# Altium schematic sheet Senkron_buck.SchDoc (part 2 of 3)
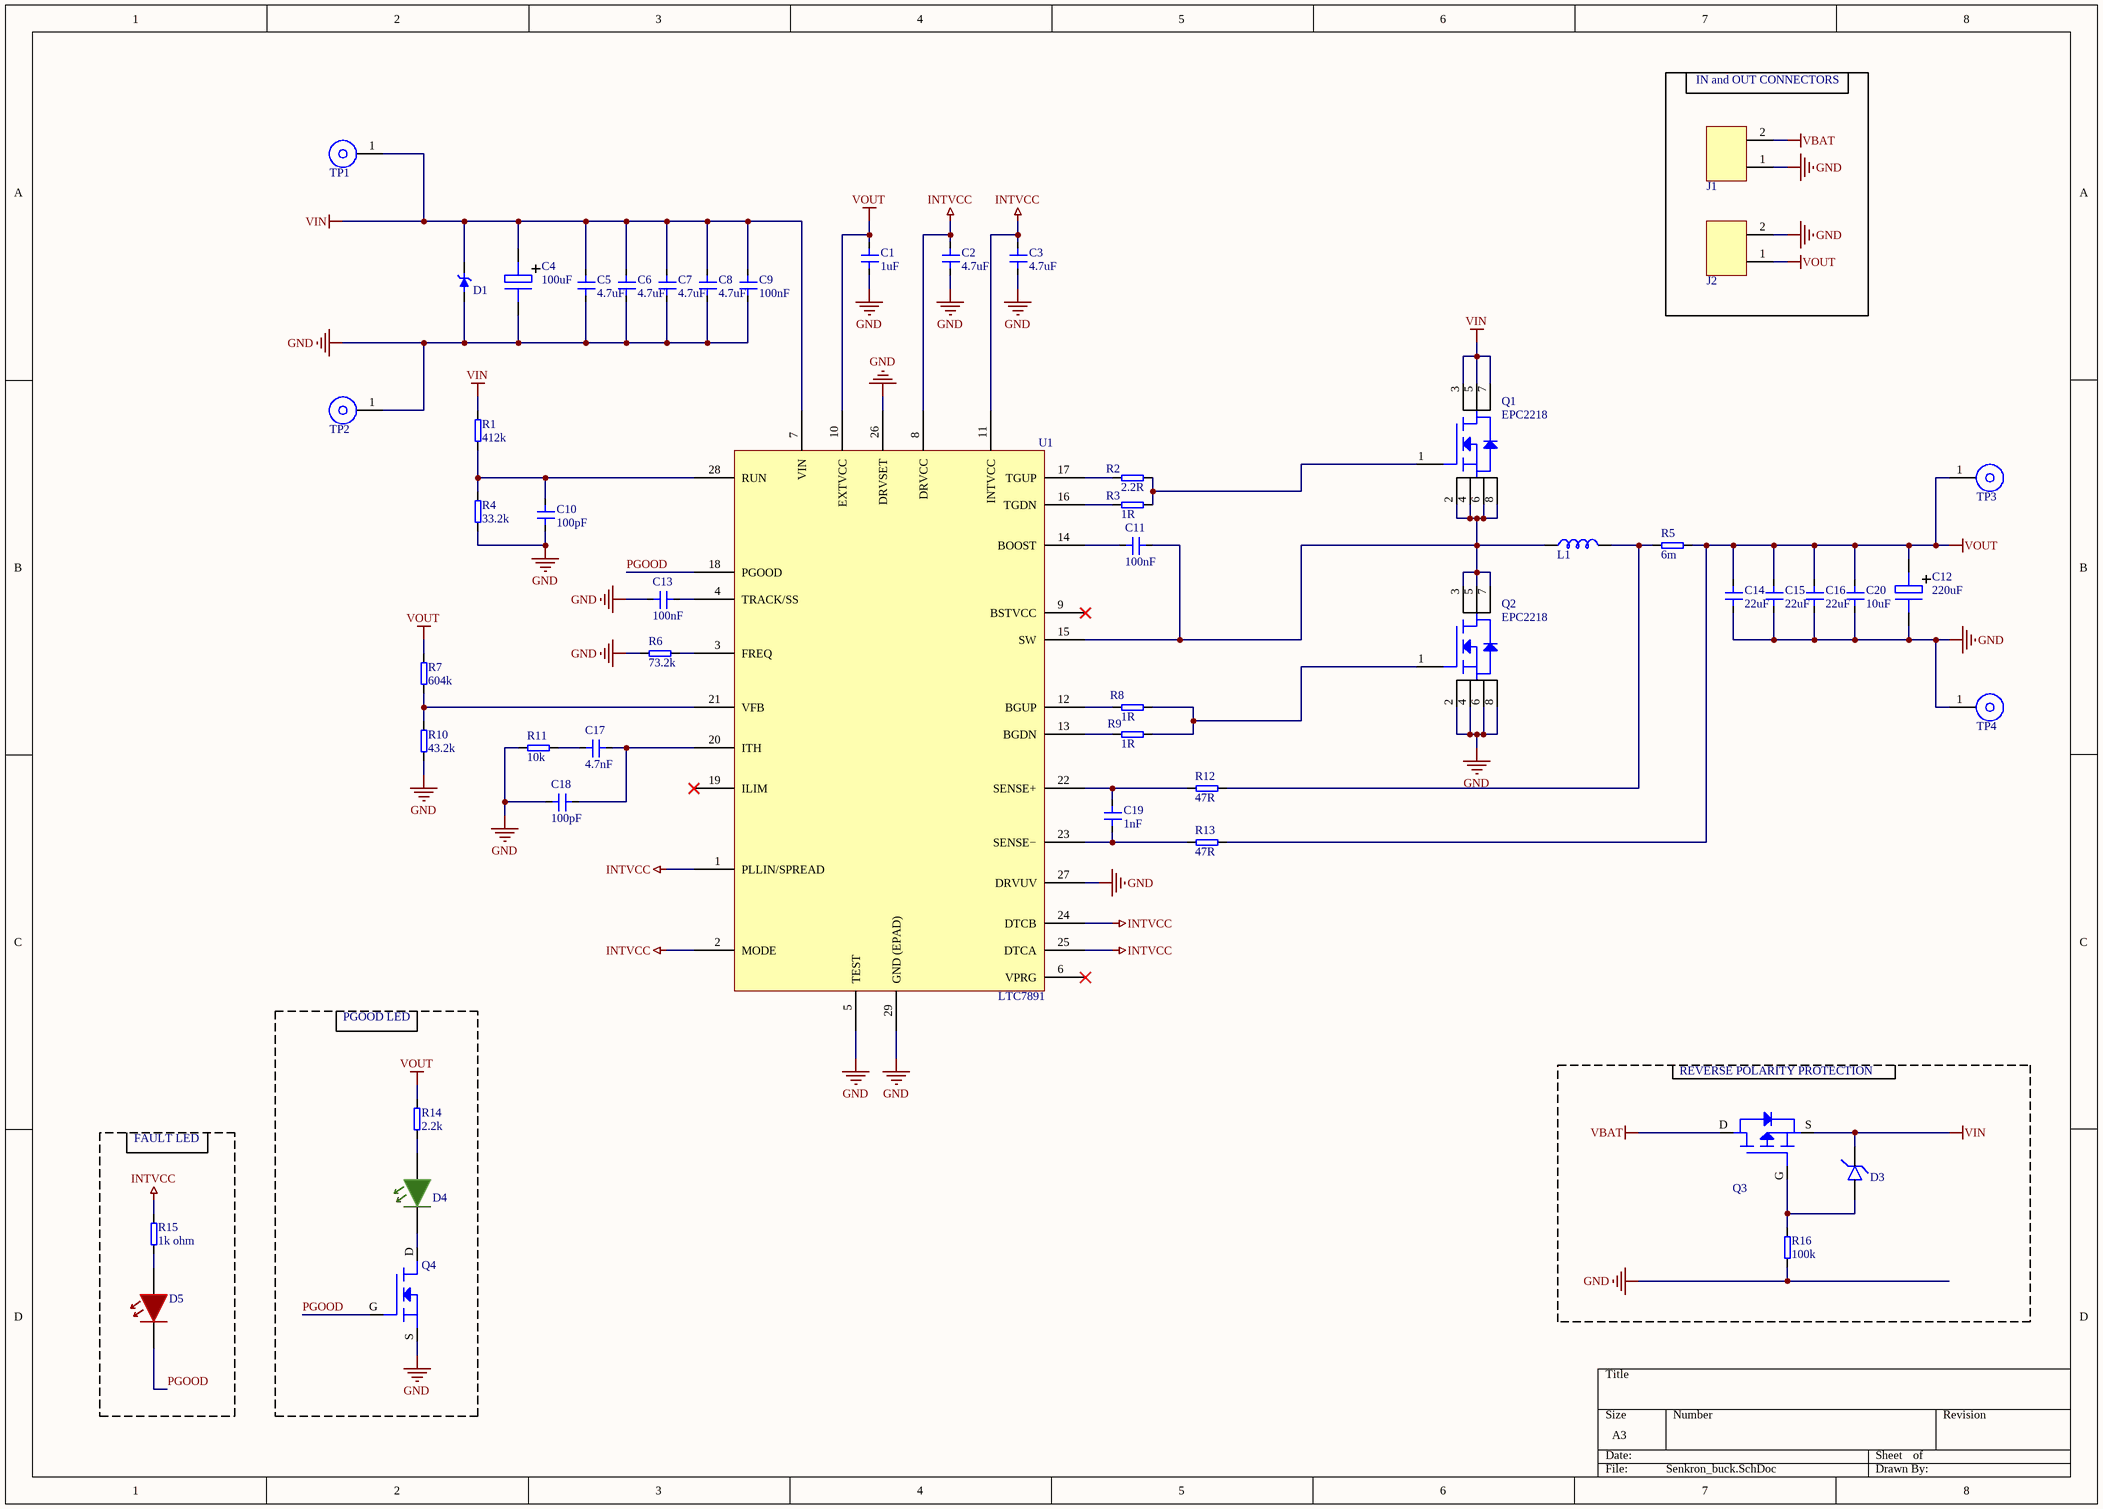
[diagram p1: Senkron_buck.SchDoc]
## Library data of the parts
C1 = Cap Cer 1uF %10  SMD 0603: Multi Layer Ceramic Capacitor (MLCC) | CAP CER 1UF 25V X7R 0603; Manufacturer: Samsung Electro-Mechanics; Manufacturer Part Number: CL10B105KA8NNNC; Value: 1µF; Tolerance: 10%; Supplier: Mouser; Supplier Part Number: 187-CL10B105KA8NNNC; RoHS: Compliant; Category: Ceramic Capacitors; Stock: 1751637; Pricing: 1=0,1, 10=0,007, 50=0,007, 100=0,007, 1000=0,007, 10000=0,006 (USD); Case/Package: 0603; Case Code (Imperial): 0603; Case Code (Metric): 1608; China RoHS: Compliant; Contact Plating: Tin; Depth: 800µm; Dielectric: X7R; Dielectric Material: Ceramic; Height: 900µm; Length: 1.6mm; Lifecycle Status: Production; Material: Ceramic; Max Operating Temperature: 125°C; Min Operating Temperature: -55°C; Mounting Technology: Surface Mount; Number of Terminals: 2; Radiation Hardening: No; REACH SVHC: Yes; Schedule B: 8532240020, 8532240020|8532240020, 8532240020|8532240020|8532240020, 8532240020|8532240020|8532240020|8532240020; Thickness: 889µm; Voltage: 25V; Voltage Rating: 25V; Voltage Rating (DC): 25V; Width: 800µm; ComponentLink1URL: https://datasheet.octopart.com:443/CL10B105KA8NNNC-Samsung-Electro-Mechanics-datasheet-182019882.pdf?src-supplier=IHS; ComponentLink1Description: https://datasheet.octopart.com:443/CL10B105KA8NNNC-Samsung-Electro-Mechanics-datasheet-182019882.pdf?src-supplier=IHS; ComponentLink2URL: https://datasheet.octopart.com:443/CL10B105KA8NNNC-Samsung-Electro-Mechanics-datasheet-106547815.pdf?src-supplier=Upverter; ComponentLink2Description: https://datasheet.octopart.com:443/CL10B105KA8NNNC-Samsung-Electro-Mechanics-datasheet-106547815.pdf?src-supplier=Upverter; ComponentLink3URL: https://datasheet.octopart.com:443/CL10B105KA8NNNC-Samsung-Electro-Mechanics-datasheet-137699931.pdf?src-supplier=Samsung+SCT; ComponentLink3Description: https://datasheet.octopart.com:443/CL10B105KA8NNNC-Samsung-Electro-Mechanics-datasheet-137699931.pdf?src-supplier=Samsung+SCT; ComponentLink4URL: https://datasheet.octopart.com:443/CL10B105KA8NNNC-Samsung-Electro-Mechanics-datasheet-116890983.pdf?src-supplier=Future+Electronics; ComponentLink4Description: https://datasheet.octopart.com:443/CL10B105KA8NNNC-Samsung-Electro-Mechanics-datasheet-116890983.pdf?src-supplier=Future+Electronics; ComponentLink5URL: https://datasheet.octopart.com:443/CL10B105KA8NNNC-Samsung-datasheet-12527851.pdf?src-supplier=Future+Electronics; ComponentLink5Description: https://datasheet.octopart.com:443/CL10B105KA8NNNC-Samsung-datasheet-12527851.pdf?src-supplier=Future+Electronics; ComponentLink6URL: https://datasheet.octopart.com:443/CL10B105KA8NNNC-Samsung-datasheet-26669022.pdf?src-supplier=Future+Electronics; ComponentLink6Description: https://datasheet.octopart.com:443/CL10B105KA8NNNC-Samsung-datasheet-26669022.pdf?src-supplier=Future+Electronics; ComponentLink7URL: https://datasheet.octopart.com:443/CL10B105KA8NNNC-Samsung-Electro-Mechanics-datasheet-149136795.pdf?src-supplier=Future+Electronics; ComponentLink7Description: https://datasheet.octopart.com:443/CL10B105KA8NNNC-Samsung-Electro-Mechanics-datasheet-149136795.pdf?src-supplier=Future+Electronics; ComponentLink8URL: https://datasheet.octopart.com:443/CL10B105KA8NNNC-Samsung-datasheet-37081328.pdf?src-supplier=Future+Electronics; ComponentLink8Description: https://datasheet.octopart.com:443/CL10B105KA8NNNC-Samsung-datasheet-37081328.pdf?src-supplier=Future+Electronics; ComponentLink9URL: https://datasheet.octopart.com/CL10B105KA8NNNC-Samsung-Electro-Mechanics-datasheet-97040617.pdf; ComponentLink9Description: https://datasheet.octopart.com/CL10B105KA8NNNC-Samsung-Electro-Mechanics-datasheet-97040617.pdf; ComponentLink10URL: https://datasheet.octopart.com/CL10B105KA8NNNC-Samsung-Electro-Mechanics-datasheet-8324245.pdf; ComponentLink10Description: https://datasheet.octopart.com/CL10B105KA8NNNC-Samsung-Electro-Mechanics-datasheet-8324245.pdf; ComponentLink11URL: https://datasheet.octopart.com:443/CL10B105KA8NNNC-Samsung-datasheet-59220082.pdf?src-supplier=TME; ComponentLink11Description: https://datasheet.octopart.com:443/CL10B105KA8NNNC-Samsung-datasheet-59220082.pdf?src-supplier=TME; ComponentLink12URL: https://datasheet.octopart.com:443/CL10B105KA8NNNC-Samsung-Electro-Mechanics-datasheet-11897796.pdf?src-supplier=Arrow+Electronics; ComponentLink12Description: https://datasheet.octopart.com:443/CL10B105KA8NNNC-Samsung-Electro-Mechanics-datasheet-11897796.pdf?src-supplier=Arrow+Electronics; ComponentLink13Description: Tedarikçi; ComponentLink13URL: https://www.ozdisan.com/p/smt-smd-ve-mlcc-kapasitorler-184/samsung-cl10b105ka8nnnc-439262
C2 C3 = Cap Cer 4.7uF %10 SMD 0603: Ceramic Capacitor, Multilayer, Ceramic, 16V, 10% +Tol, 10% -Tol, X5R, +-15% TC, 4.7uF, Surface Mount, 0603 inch; Manufacturer: Samsung Electro-Mechanics; Manufacturer Part Number: CL10A475KO8NNNC; Value: 4.7µF; Supplier: Mouser; Supplier Part Number: 187-CL10A475KO8NNNC; RoHS: Compliant; Category: Ceramic Capacitors; Stock: 255576; Pricing: 1=0,1, 10=0,014, 50=0,014, 100=0,014, 1000=0,014, 10000=0,014 (USD); Case/Package: 0603; Case Code (Imperial): 0603; Case Code (Metric): 1608; China RoHS: Compliant; Contact Plating: Tin; Depth: 800µm; Dielectric: X5R; Dielectric Material: Ceramic; Height: 900µm; Length: 1.6mm; Lifecycle Status: NRND; Material: Ceramic; Max Operating Temperature: 85°C; Min Operating Temperature: -55°C; Mounting Technology: Surface Mount; Number of Terminals: 2; Radiation Hardening: No; REACH SVHC: Yes; Schedule B: 8532240020, 8532240020|8532240020|8532240020|8532240020|8532240020|8532240020|8532240020|8532240020|8532240020|8532240020|8532240020|8532240020|8532240020|8532240020|8532240020|8532240020|8532240020|8532240020|8532240020|8532240020|8532240020|8532240020|8532240020|85; Thickness: 889µm; Tolerance: 10%; Voltage: 16V; Voltage Rating: 16V; Voltage Rating (DC): 16V; Width: 800µm; ComponentLink1URL: https://datasheet.octopart.com:443/CL10A475KO8NNNC-Samsung-Electro-Mechanics-datasheet-136031787.pdf?src-supplier=IHS; ComponentLink1Description: https://datasheet.octopart.com:443/CL10A475KO8NNNC-Samsung-Electro-Mechanics-datasheet-136031787.pdf?src-supplier=IHS; ComponentLink2URL: https://datasheet.octopart.com:443/CL10A475KO8NNNC-Samsung-Electro-Mechanics-datasheet-81461811.pdf?src-supplier=Upverter; ComponentLink2Description: https://datasheet.octopart.com:443/CL10A475KO8NNNC-Samsung-Electro-Mechanics-datasheet-81461811.pdf?src-supplier=Upverter; ComponentLink3URL: https://datasheet.octopart.com/CL10A475KO8NNNC-Samsung-Electro-Mechanics-datasheet-8324245.pdf; ComponentLink3Description: https://datasheet.octopart.com/CL10A475KO8NNNC-Samsung-Electro-Mechanics-datasheet-8324245.pdf; ComponentLink4URL: https://datasheet.octopart.com/CL10A475KO8NNNC-Samsung-Electro-Mechanics-datasheet-97040617.pdf; ComponentLink4Description: https://datasheet.octopart.com/CL10A475KO8NNNC-Samsung-Electro-Mechanics-datasheet-97040617.pdf; ComponentLink5URL: https://datasheet.octopart.com/General-Multilayer-Ceramic-Capacitors-Samsung-datasheet-family-111.pdf; ComponentLink5Description: https://datasheet.octopart.com/General-Multilayer-Ceramic-Capacitors-Samsung-datasheet-family-111.pdf; ComponentLink6URL: https://datasheet.octopart.com:443/CL10A475KO8NNNC-Samsung-Electro-Mechanics-datasheet-110226305.pdf?src-supplier=Future+Electronics; ComponentLink6Description: https://datasheet.octopart.com:443/CL10A475KO8NNNC-Samsung-Electro-Mechanics-datasheet-110226305.pdf?src-supplier=Future+Electronics; ComponentLink7URL: https://datasheet.octopart.com:443/CL10A475KO8NNNC-Samsung-datasheet-44382858.pdf?src-supplier=Future+Electronics; ComponentLink7Description: https://datasheet.octopart.com:443/CL10A475KO8NNNC-Samsung-datasheet-44382858.pdf?src-supplier=Future+Electronics; ComponentLink8URL: https://datasheet.octopart.com:443/CL10A475KO8NNNC-Samsung-datasheet-12513645.pdf?src-supplier=Future+Electronics; ComponentLink8Description: https://datasheet.octopart.com:443/CL10A475KO8NNNC-Samsung-datasheet-12513645.pdf?src-supplier=Future+Electronics; ComponentLink9URL: https://datasheet.octopart.com:443/CL10A475KO8NNNC-Samsung-datasheet-26589133.pdf?src-supplier=Future+Electronics; ComponentLink9Description: https://datasheet.octopart.com:443/CL10A475KO8NNNC-Samsung-datasheet-26589133.pdf?src-supplier=Future+Electronics; ComponentLink10URL: https://datasheet.octopart.com:443/CL10A475KO8NNNC-Samsung-datasheet-11541288.pdf?src-supplier=Future+Electronics; ComponentLink10Description: https://datasheet.octopart.com:443/CL10A475KO8NNNC-Samsung-datasheet-11541288.pdf?src-supplier=Future+Electronics; ComponentLink11URL: https://datasheet.octopart.com:443/CL10A475KO8NNNC-Samsung-Electro-Mechanics-datasheet-149158806.pdf?src-supplier=Future+Electronics; ComponentLink11Description: https://datasheet.octopart.com:443/CL10A475KO8NNNC-Samsung-Electro-Mechanics-datasheet-149158806.pdf?src-supplier=Future+Electronics; ComponentLink12URL: https://datasheet.octopart.com:443/CL10A475KO8NNNC-Samsung-Electro-Mechanics-datasheet-11892693.pdf?src-supplier=Arrow+Electronics; ComponentLink12Description: https://datasheet.octopart.com:443/CL10A475KO8NNNC-Samsung-Electro-Mechanics-datasheet-11892693.pdf?src-supplier=Arrow+Electronics; ComponentLink13URL: https://datasheet.octopart.com:443/CL10A475KO8NNNC-Samsung-datasheet-59220082.pdf?src-supplier=TME; ComponentLink13Description: https://datasheet.octopart.com:443/CL10A475KO8NNNC-Samsung-datasheet-59220082.pdf?src-supplier=TME; ComponentLink14URL: http://sigma.octopart.com:80/rohs_certificate/General-Multilayer-Ceramic-Capacitors-Samsung-family-110.pdf?src-supplier=Compliance+Statements; ComponentLink14Description: http://sigma.octopart.com:80/rohs_certificate/General-Multilayer-Ceramic-Capacitors-Samsung-family-110.pdf?src-supplier=Compliance+Statements; ComponentLink15URL: http://sigma.octopart.com:80/rohs_statement/General-Multilayer-Ceramic-Capacitors-Samsung-family-132.pdf?src-supplier=Compliance+Statements; ComponentLink15Description: http://sigma.octopart.com:80/rohs_statement/General-Multilayer-Ceramic-Capacitors-Samsung-family-132.pdf?src-supplier=Compliance+Statements; ComponentLink16URL: http://sigma.octopart.com:80/reach_statement/General-Multilayer-Ceramic-Capacitors-Samsung-family-133.pdf?src-supplier=Compliance+Statements; ComponentLink16Description: http://sigma.octopart.com:80/reach_statement/General-Multilayer-Ceramic-Capacitors-Samsung-family-133.pdf?src-supplier=Compliance+Statements; ComponentLink17Description: Tedarikçi; ComponentLink17URL: https://www.ozdisan.com/p/smt-smd-ve-mlcc-kapasitorler-184/samsung-cl10a475ko8nnnc-522172
C4 = Cap Elec 100uF 80V SMD: CAP.EL.100uF 80V 10x12.5 105C 2000Hrs SMD; Üretici Ürün Kodu: MRE-080V101MG125-T/R; Montaj Tipi: SMT; Voltaj Değeri: 80VDC; Kapasitör Tipi: Electrolytic; Tolerans: ±20 %; ComponentLink1Description: Tedarikçi; ComponentLink1URL: https://www.ozdisan.com/p/aluminyum-kapasitorler-180/koshin-mre-080v101mg125-t-r-744332; Kapasitans: 100uF
C5-C8 = Cap Cer 4.7uF %10 SMD 1210: Ceramic Capacitor, Multilayer, Ceramic, 50V, 10% +Tol, 10% -Tol, X7R, +-15% TC, 4.7uF, Surface Mount, 1210 inch; Manufacturer: Samsung Electro-Mechanics; Manufacturer Part Number: CL32B475KBJNNNE; Value: 4.7µF; Supplier: Mouser; Supplier Part Number: 187-CL32B475KBJNNNE; RoHS: Compliant; Category: Ceramic Capacitors; Stock: 29847; Pricing: 1=0,53, 10=0,338, 50=0,338, 100=0,238, 1000=0,15, 10000=0,121 (USD); Case/Package: 1210; China RoHS: Compliant; Dielectric: X7R; Dielectric Material: Ceramic; Height: 2.7mm; Lead Free: Lead Free; Length: 3.2mm; Lifecycle Status: Production; Material: Ceramic; Max Operating Temperature: 125°C; Min Operating Temperature: -55°C; Mounting Technology: Surface Mount; Number of Terminals: 2; REACH SVHC: Yes; Tolerance: 10%; Voltage Rating: 50V; Voltage Rating (DC): 50V; Width: 2.5mm; ComponentLink1URL: https://datasheet.octopart.com:443/CL32B475KBJNNNE-Samsung-Electro-Mechanics-datasheet-136482674.pdf?src-supplier=IHS; ComponentLink1Description: https://datasheet.octopart.com:443/CL32B475KBJNNNE-Samsung-Electro-Mechanics-datasheet-136482674.pdf?src-supplier=IHS; ComponentLink2URL: https://datasheet.octopart.com:443/CL32B475KBJNNNE-Samsung-Electro-Mechanics-datasheet-149049220.pdf?src-supplier=Future+Electronics; ComponentLink2Description: https://datasheet.octopart.com:443/CL32B475KBJNNNE-Samsung-Electro-Mechanics-datasheet-149049220.pdf?src-supplier=Future+Electronics; ComponentLink3URL: https://datasheet.octopart.com:443/CL32B475KBJNNNE-Samsung-Electro-Mechanics-datasheet-116120939.pdf?src-supplier=Future+Electronics; ComponentLink3Description: https://datasheet.octopart.com:443/CL32B475KBJNNNE-Samsung-Electro-Mechanics-datasheet-116120939.pdf?src-supplier=Future+Electronics; ComponentLink4URL: https://datasheet.octopart.com:443/CL32B475KBJNNNE-Samsung-Electro-Mechanics-datasheet-81462655.pdf?src-supplier=Future+Electronics; ComponentLink4Description: https://datasheet.octopart.com:443/CL32B475KBJNNNE-Samsung-Electro-Mechanics-datasheet-81462655.pdf?src-supplier=Future+Electronics; ComponentLink5URL: https://datasheet.octopart.com:443/CL32B475KBJNNNE-Samsung-datasheet-66660282.pdf?src-supplier=Future+Electronics; ComponentLink5Description: https://datasheet.octopart.com:443/CL32B475KBJNNNE-Samsung-datasheet-66660282.pdf?src-supplier=Future+Electronics; ComponentLink6URL: https://datasheet.octopart.com:443/CL32B475KBJNNNE-Samsung-datasheet-58578007.pdf?src-supplier=Future+Electronics; ComponentLink6Description: https://datasheet.octopart.com:443/CL32B475KBJNNNE-Samsung-datasheet-58578007.pdf?src-supplier=Future+Electronics; ComponentLink7URL: https://datasheet.octopart.com:443/CL32B475KBJNNNE-Samsung-datasheet-37081328.pdf?src-supplier=Future+Electronics; ComponentLink7Description: https://datasheet.octopart.com:443/CL32B475KBJNNNE-Samsung-datasheet-37081328.pdf?src-supplier=Future+Electronics; ComponentLink8URL: https://datasheet.octopart.com/CL32B475KBJNNNE-Samsung-Electro-Mechanics-datasheet-97040617.pdf; ComponentLink8Description: https://datasheet.octopart.com/CL32B475KBJNNNE-Samsung-Electro-Mechanics-datasheet-97040617.pdf; ComponentLink9URL: https://datasheet.octopart.com/CL32B475KBJNNNE-Samsung-Electro-Mechanics-datasheet-8324245.pdf; ComponentLink9Description: https://datasheet.octopart.com/CL32B475KBJNNNE-Samsung-Electro-Mechanics-datasheet-8324245.pdf; ComponentLink10URL: https://datasheet.octopart.com/General-Multilayer-Ceramic-Capacitors-Samsung-datasheet-family-111.pdf; ComponentLink10Description: https://datasheet.octopart.com/General-Multilayer-Ceramic-Capacitors-Samsung-datasheet-family-111.pdf; ComponentLink11URL: http://sigma.octopart.com:80/rohs_certificate/General-Multilayer-Ceramic-Capacitors-Samsung-family-110.pdf?src-supplier=Compliance+Statements; ComponentLink11Description: http://sigma.octopart.com:80/rohs_certificate/General-Multilayer-Ceramic-Capacitors-Samsung-family-110.pdf?src-supplier=Compliance+Statements; ComponentLink12URL: http://sigma.octopart.com:80/rohs_statement/General-Multilayer-Ceramic-Capacitors-Samsung-family-132.pdf?src-supplier=Compliance+Statements; ComponentLink12Description: http://sigma.octopart.com:80/rohs_statement/General-Multilayer-Ceramic-Capacitors-Samsung-family-132.pdf?src-supplier=Compliance+Statements; ComponentLink13URL: http://sigma.octopart.com:80/reach_statement/General-Multilayer-Ceramic-Capacitors-Samsung-family-133.pdf?src-supplier=Compliance+Statements; ComponentLink13Description: http://sigma.octopart.com:80/reach_statement/General-Multilayer-Ceramic-Capacitors-Samsung-family-133.pdf?src-supplier=Compliance+Statements; ComponentLink14Description: Tedarikçi; ComponentLink14URL: https://www.ozdisan.com/p/smt-smd-ve-mlcc-kapasitorler-184/samsung-cl32b475kbjnnne-1206577
C9 C11 C13 = Cap Cer 0.1uF %10 SMD 0603: Ceramic Capacitor, Multilayer, Ceramic, 50V, 5% +Tol, 5% -Tol, X7R, 15% TC, 0.1uF, Surface Mount, 0603; Manufacturer: KEMET; Manufacturer Part Number: C0603C104J5RAC7867; Designed by: Eren/Mehmet; Multilayer: Yes; Supplier: Mouser; Supplier Part Number: 80-C0603C104J5R; RoHS: Yes; Category: Ceramic Capacitors; Stock: 477636; Pricing: 1=0,12, 10=0,049, 50=0,049, 100=0,029, 1000=0,027, 10000=0,01 (USD); Mounting Technology: Surface Mount; Pins: 2; Dielectric Material: Ceramic; Package Shape: Rectangular; Case/Package: 0603; Terminal Finish: Nickel; Min Operating Temperature: -55°C; Max Operating Temperature: 125°C; JESD-609 Code: e3; Value: 100nF; Capacitor Type: Ceramic; Tolerance  (fill in as +-): 5%; Package Style: SMTMeter; Packaging: Tape and Reel; Tolerance (fill in as +-): 5%; Rated DC Voltage (URdc): 50V; Temperature Characteristics Code: X7R; Termination: Wraparound; Length: 1.6mm; Width: 0.8mm; Height: 0.8mm; Reach SVHC Compliant: Yes; RoHS Compliant: Yes; ComponentLink1URL: https://datasheet.ciiva.com:443/pdfs/VipMasterIC/IC/KEME/KEME-S-A0008991654/KEME-S-A0008991654-1.pdf?src-supplier=IHS+Markit; ComponentLink1Description: Datasheet; ComponentLink2URL: https://datasheet.ciiva.com/28645/1851736-28645621.pdf?src-supplier=Element14; ComponentLink2Description: https://datasheet.ciiva.com/28645/1851736-28645621.pdf?src-supplier=Element14; ComponentLink3URL: https://datasheet.ciiva.com/46385/1851736-46385374.pdf?src-supplier=Element14; ComponentLink3Description: https://datasheet.ciiva.com/46385/1851736-46385374.pdf?src-supplier=Element14; ComponentLink4URL: https://datasheet.ciiva.com/46424/1851736-46424174.pdf?src-supplier=Element14; ComponentLink4Description: https://datasheet.ciiva.com/46424/1851736-46424174.pdf?src-supplier=Element14; ComponentLink5URL: https://datasheet.ciiva.com/18192/getdatasheetpartid-347940-18192678.pdf?src-supplier=Verical; ComponentLink5Description: https://datasheet.ciiva.com/18192/getdatasheetpartid-347940-18192678.pdf?src-supplier=Verical; ComponentLink6URL: https://datasheet.ciiva.com/18100/getdatasheetpartid-37078-18100981.pdf?src-supplier=Verical; ComponentLink6Description: https://datasheet.ciiva.com/18100/getdatasheetpartid-37078-18100981.pdf?src-supplier=Verical; ComponentLink7Description: Supplier; ComponentLink7URL: https://www.ozdisan.com/pasif-komponentler/kapasitorler/smt-smd-ve-mlcc-kapasitorler/C0603C104J5RAC7867/610231
C10 C18 = Cap Cer 100pF %1 SMD 0603: Ceramic Capacitor, Multilayer, Ceramic, 50V, 5% +Tol, 5% -Tol, C0G, 0+-30ppm/Celcius TC, 100pF, Surface Mount, 0603...; Manufacturer: Samsung Electro-Mechanics; Manufacturer Part Number: CL10C101JB8NNNC; Number of Channels: 1; Temperature Coefficient: 30ppm/°C; Supplier: Mouser; Supplier Part Number: 187-CL10C101JB8NNNC; RoHS: Compliant; Category: Ceramic Capacitors; Stock: 310924; Pricing: 1=0,1, 10=0,04, 50=0,04, 100=0,004, 1000=0,004, 10000=0,004 (USD); Value: 100pF; Case/Package: 0603; Case Code (Imperial): 0603; Case Code (Metric): 1608; China RoHS: Compliant; Contact Plating: Tin; Depth: 800µm; Dielectric: C0G; Dielectric Material: Ceramic; Height: 900µm; Lead Free: Lead Free; Length: 1.6mm; Lifecycle Status: Production; Material: Ceramic; Max Operating Temperature: 125°C; Min Operating Temperature: -55°C; Mounting Technology: Surface Mount; Number of Terminals: 2; Radiation Hardening: No; REACH SVHC: Yes; Schedule B: 8532240020, 8532240020|8532240020, 8532240020|8532240020|8532240020, 8532240020|8532240020|8532240020|8532240020; Thickness: 889µm; Tolerance: 5%; Voltage: 50V; Voltage Rating: 50V; Voltage Rating (DC): 50V; Width: 800µm; ComponentLink1URL: https://datasheet.octopart.com:443/CL10C101JB8NNNC-Samsung-Electro-Mechanics-datasheet-136482390.pdf?src-supplier=IHS; ComponentLink1Description: https://datasheet.octopart.com:443/CL10C101JB8NNNC-Samsung-Electro-Mechanics-datasheet-136482390.pdf?src-supplier=IHS; ComponentLink2URL: https://datasheet.octopart.com/CL10C101JB8NNNC-Samsung-Electro-Mechanics-datasheet-8324245.pdf; ComponentLink2Description: https://datasheet.octopart.com/CL10C101JB8NNNC-Samsung-Electro-Mechanics-datasheet-8324245.pdf; ComponentLink3URL: https://datasheet.octopart.com/CL10C101JB8NNNC-Samsung-Electro-Mechanics-datasheet-97040617.pdf; ComponentLink3Description: https://datasheet.octopart.com/CL10C101JB8NNNC-Samsung-Electro-Mechanics-datasheet-97040617.pdf; ComponentLink4URL: https://datasheet.octopart.com/General-Multilayer-Ceramic-Capacitors-Samsung-datasheet-family-111.pdf; ComponentLink4Description: https://datasheet.octopart.com/General-Multilayer-Ceramic-Capacitors-Samsung-datasheet-family-111.pdf; ComponentLink5URL: https://datasheet.octopart.com:443/CL10C101JB8NNNC-Samsung-Electro-Mechanics-datasheet-110326842.pdf?src-supplier=Future+Electronics; ComponentLink5Description: https://datasheet.octopart.com:443/CL10C101JB8NNNC-Samsung-Electro-Mechanics-datasheet-110326842.pdf?src-supplier=Future+Electronics; ComponentLink6URL: https://datasheet.octopart.com:443/CL10C101JB8NNNC-Samsung-Electro-Mechanics-datasheet-81461969.pdf?src-supplier=Future+Electronics; ComponentLink6Description: https://datasheet.octopart.com:443/CL10C101JB8NNNC-Samsung-Electro-Mechanics-datasheet-81461969.pdf?src-supplier=Future+Electronics; ComponentLink7URL: https://datasheet.octopart.com:443/CL10C101JB8NNNC-Samsung-datasheet-12521739.pdf?src-supplier=Future+Electronics; ComponentLink7Description: https://datasheet.octopart.com:443/CL10C101JB8NNNC-Samsung-datasheet-12521739.pdf?src-supplier=Future+Electronics; ComponentLink8URL: https://datasheet.octopart.com:443/CL10C101JB8NNNC-Samsung-datasheet-26669111.pdf?src-supplier=Future+Electronics; ComponentLink8Description: https://datasheet.octopart.com:443/CL10C101JB8NNNC-Samsung-datasheet-26669111.pdf?src-supplier=Future+Electronics; ComponentLink9URL: https://datasheet.octopart.com:443/CL10C101JB8NNNC-Samsung-datasheet-8328827.pdf?src-supplier=Future+Electronics; ComponentLink9Description: https://datasheet.octopart.com:443/CL10C101JB8NNNC-Samsung-datasheet-8328827.pdf?src-supplier=Future+Electronics; ComponentLink10URL: https://datasheet.octopart.com:443/CL10C101JB8NNNC-Samsung-Electro-Mechanics-datasheet-149154131.pdf?src-supplier=Future+Electronics; ComponentLink10Description: https://datasheet.octopart.com:443/CL10C101JB8NNNC-Samsung-Electro-Mechanics-datasheet-149154131.pdf?src-supplier=Future+Electronics; ComponentLink11URL: https://datasheet.octopart.com:443/CL10C101JB8NNNC-Samsung-datasheet-8326407.pdf?src-supplier=TME; ComponentLink11Description: https://datasheet.octopart.com:443/CL10C101JB8NNNC-Samsung-datasheet-8326407.pdf?src-supplier=TME; ComponentLink12URL: http://sigma.octopart.com:80/rohs_certificate/General-Multilayer-Ceramic-Capacitors-Samsung-family-110.pdf?src-supplier=Compliance+Statements; ComponentLink12Description: http://sigma.octopart.com:80/rohs_certificate/General-Multilayer-Ceramic-Capacitors-Samsung-family-110.pdf?src-supplier=Compliance+Statements; ComponentLink13URL: http://sigma.octopart.com:80/rohs_statement/General-Multilayer-Ceramic-Capacitors-Samsung-family-132.pdf?src-supplier=Compliance+Statements; ComponentLink13Description: http://sigma.octopart.com:80/rohs_statement/General-Multilayer-Ceramic-Capacitors-Samsung-family-132.pdf?src-supplier=Compliance+Statements; ComponentLink14URL: http://sigma.octopart.com:80/reach_statement/General-Multilayer-Ceramic-Capacitors-Samsung-family-133.pdf?src-supplier=Compliance+Statements; ComponentLink14Description: http://sigma.octopart.com:80/reach_statement/General-Multilayer-Ceramic-Capacitors-Samsung-family-133.pdf?src-supplier=Compliance+Statements; ComponentLink15Description: Tedarikçi; ComponentLink15URL: https://www.ozdisan.com/p/smt-smd-ve-mlcc-kapasitorler-184/samsung-cl10c101jb8nnnc-11970
C12 = Cap Elec 220uF %20 50V SMD: CAP.EL.220uF 50V 10x10 105C 2000Hrs SMD; Tolerans: ±20 %; Voltaj Değeri: 50VDC; Montaj Tipi: SMT; Kapasitör Tipi: Electrolytic; Üretici Ürün Kodu: MRW-050V221MG105-T/R; ComponentLink1Description: Tedarikçi; ComponentLink1URL: https://www.ozdisan.com/p/aluminyum-kapasitorler-180/koshin-mrw-050v221mg105-t-r-465905; Kapasitans: 220uF; ComponentLink2Description: Tedarikçi_2; ComponentLink2URL: https://www.ozdisan.com/p/aluminyum-kapasitorler-180/samwha-sc1h227m10010vr-345601
C14-C16 = Cap Cer 22uF %10 SMD 1210: 25V 22uF X7R ±10% 1210 Multilayer Ceramic Capacitors MLCC - SMD/SMT ROHS; Manufacturer: Samsung Electro-Mechanics; Manufacturer Part Number: CL32B226KAJNNNE; Value: 22µF; Supplier: Mouser; Supplier Part Number: 187-CL32B226KAJNNNE; RoHS: Compliant; Category: Ceramic Capacitors; Stock: 357816; Pricing: 1=0,56, 10=0,26, 50=0,26, 100=0,232, 1000=0,169, 10000=0,138 (USD); Case/Package: 1210; Case Code (Imperial): 1210; Case Code (Metric): 3225; China RoHS: Compliant; Depth: 2.5mm; Dielectric: X7R; Dielectric Material: Ceramic; Height: 2.7mm; Lead Free: Lead Free; Length: 3.2mm; Lifecycle Status: Production; Material: Ceramic; Max Operating Temperature: 125°C; Min Operating Temperature: -55°C; Mounting Technology: Surface Mount; Number of Terminals: 2; Radiation Hardening: No; REACH SVHC: Yes; Schedule B: 8532240020, 8532240020|8532240020|8532240020|8532240020|8532240020|8532240020|8532240020|8532240020|8532240020|8532240020|8532240020|8532240020|8532240020|8532240020|8532240020|8532240020|8532240020|8532240020|8532240020|8532240020|8532240020|8532240020|8532240020|85; Thickness: 2.6924mm; Tolerance: 10%; Voltage Rating: 25V; Voltage Rating (DC): 25V; Width: 2.5mm; ComponentLink1URL: https://datasheet.octopart.com:443/CL32B226KAJNNNE-Samsung-Electro-Mechanics-datasheet-136482669.pdf?src-supplier=Newark; ComponentLink1Description: https://datasheet.octopart.com:443/CL32B226KAJNNNE-Samsung-Electro-Mechanics-datasheet-136482669.pdf?src-supplier=Newark; ComponentLink2URL: https://datasheet.octopart.com:443/CL32B226KAJNNNE-Samsung-Electro-Mechanics-datasheet-149049204.pdf?src-supplier=Future+Electronics; ComponentLink2Description: https://datasheet.octopart.com:443/CL32B226KAJNNNE-Samsung-Electro-Mechanics-datasheet-149049204.pdf?src-supplier=Future+Electronics; ComponentLink3URL: https://datasheet.octopart.com:443/CL32B226KAJNNNE-Samsung-Electro-Mechanics-datasheet-116051342.pdf?src-supplier=Future+Electronics; ComponentLink3Description: https://datasheet.octopart.com:443/CL32B226KAJNNNE-Samsung-Electro-Mechanics-datasheet-116051342.pdf?src-supplier=Future+Electronics; ComponentLink4URL: https://datasheet.octopart.com:443/CL32B226KAJNNNE-Samsung-Electro-Mechanics-datasheet-81462649.pdf?src-supplier=Future+Electronics; ComponentLink4Description: https://datasheet.octopart.com:443/CL32B226KAJNNNE-Samsung-Electro-Mechanics-datasheet-81462649.pdf?src-supplier=Future+Electronics; ComponentLink5URL: https://datasheet.octopart.com:443/CL32B226KAJNNNE-Samsung-datasheet-42485260.pdf?src-supplier=Future+Electronics; ComponentLink5Description: https://datasheet.octopart.com:443/CL32B226KAJNNNE-Samsung-datasheet-42485260.pdf?src-supplier=Future+Electronics; ComponentLink6URL: https://datasheet.octopart.com:443/CL32B226KAJNNNE-Samsung-datasheet-28848742.pdf?src-supplier=Future+Electronics; ComponentLink6Description: https://datasheet.octopart.com:443/CL32B226KAJNNNE-Samsung-datasheet-28848742.pdf?src-supplier=Future+Electronics; ComponentLink7URL: https://datasheet.octopart.com:443/CL32B226KAJNNNE-Samsung-datasheet-37081328.pdf?src-supplier=Future+Electronics; ComponentLink7Description: https://datasheet.octopart.com:443/CL32B226KAJNNNE-Samsung-datasheet-37081328.pdf?src-supplier=Future+Electronics; ComponentLink8URL: https://datasheet.octopart.com/CL32B226KAJNNNE-Samsung-Electro-Mechanics-datasheet-97040617.pdf; ComponentLink8Description: https://datasheet.octopart.com/CL32B226KAJNNNE-Samsung-Electro-Mechanics-datasheet-97040617.pdf; ComponentLink9URL: https://datasheet.octopart.com/CL32B226KAJNNNE-Samsung-Electro-Mechanics-datasheet-8324245.pdf; ComponentLink9Description: https://datasheet.octopart.com/CL32B226KAJNNNE-Samsung-Electro-Mechanics-datasheet-8324245.pdf; ComponentLink10URL: https://datasheet.octopart.com/General-Multilayer-Ceramic-Capacitors-Samsung-datasheet-family-111.pdf; ComponentLink10Description: https://datasheet.octopart.com/General-Multilayer-Ceramic-Capacitors-Samsung-datasheet-family-111.pdf; ComponentLink11URL: https://datasheet.octopart.com:443/CL32B226KAJNNNE-Samsung-datasheet-59220082.pdf?src-supplier=TME; ComponentLink11Description: https://datasheet.octopart.com:443/CL32B226KAJNNNE-Samsung-datasheet-59220082.pdf?src-supplier=TME; ComponentLink12URL: http://sigma.octopart.com:80/rohs_certificate/General-Multilayer-Ceramic-Capacitors-Samsung-family-110.pdf?src-supplier=Compliance+Statements; ComponentLink12Description: http://sigma.octopart.com:80/rohs_certificate/General-Multilayer-Ceramic-Capacitors-Samsung-family-110.pdf?src-supplier=Compliance+Statements; ComponentLink13URL: http://sigma.octopart.com:80/rohs_statement/General-Multilayer-Ceramic-Capacitors-Samsung-family-132.pdf?src-supplier=Compliance+Statements; ComponentLink13Description: http://sigma.octopart.com:80/rohs_statement/General-Multilayer-Ceramic-Capacitors-Samsung-family-132.pdf?src-supplier=Compliance+Statements; ComponentLink14URL: http://sigma.octopart.com:80/reach_statement/General-Multilayer-Ceramic-Capacitors-Samsung-family-133.pdf?src-supplier=Compliance+Statements; ComponentLink14Description: http://sigma.octopart.com:80/reach_statement/General-Multilayer-Ceramic-Capacitors-Samsung-family-133.pdf?src-supplier=Compliance+Statements; ComponentLink15Description: Tedarikçi; ComponentLink15URL: https://www.ozdisan.com/p/smt-smd-ve-mlcc-kapasitorler-184/samsung-cl32b226kajnnne-402056
C17 = Cap Cer 4.7nF %10 SMD 0603: Ceramic Capacitor, Multilayer, Ceramic, 50V, 10% +Tol, 10% -Tol, X7R, +-15% TC, 4.7nF, Surface Mount, 0603 inch; Manufacturer: Samsung Electro-Mechanics; Manufacturer Part Number: CL10B472KB8NNNC; Supplier: Mouser; Supplier Part Number: 187-CL10B472KB8NNNC; RoHS: Compliant; Category: Ceramic Capacitors; Stock: 124924; Pricing: 1=0,1, 10=0,017, 50=0,017, 100=0,015, 1000=0,009, 10000=0,004 (USD); Value: 4.7nF; Case/Package: 0603; Case Code (Imperial): 0603; Case Code (Metric): 1608; China RoHS: Compliant; Contact Plating: Tin; Depth: 800µm; Dielectric: X7R; Dielectric Material: Ceramic; Height: 900µm; Lead Free: Lead Free; Length: 1.6mm; Lifecycle Status: Production; Material: Ceramic; Max Operating Temperature: 125°C; Min Operating Temperature: -55°C; Mounting Technology: Surface Mount; Number of Terminals: 2; Radiation Hardening: No; REACH SVHC: Yes; Schedule B: 8532240020, 8532240020|8532240020, 8532240020|8532240020|8532240020, 8532240020|8532240020|8532240020|8532240020; Thickness: 889µm; Tolerance: 10%; Voltage: 50V; Voltage Rating: 50V; Voltage Rating (DC): 50V; Width: 800µm; ComponentLink1URL: https://datasheet.octopart.com:443/CL10B472KB8NNNC-Samsung-Electro-Mechanics-datasheet-136482355.pdf?src-supplier=IHS; ComponentLink1Description: https://datasheet.octopart.com:443/CL10B472KB8NNNC-Samsung-Electro-Mechanics-datasheet-136482355.pdf?src-supplier=IHS; ComponentLink2URL: https://datasheet.octopart.com/CL10B472KB8NNNC-Samsung-Electro-Mechanics-datasheet-8324245.pdf; ComponentLink2Description: https://datasheet.octopart.com/CL10B472KB8NNNC-Samsung-Electro-Mechanics-datasheet-8324245.pdf; ComponentLink3URL: https://datasheet.octopart.com/CL10B472KB8NNNC-Samsung-Electro-Mechanics-datasheet-97040617.pdf; ComponentLink3Description: https://datasheet.octopart.com/CL10B472KB8NNNC-Samsung-Electro-Mechanics-datasheet-97040617.pdf; ComponentLink4URL: https://datasheet.octopart.com/General-Multilayer-Ceramic-Capacitors-Samsung-datasheet-family-111.pdf; ComponentLink4Description: https://datasheet.octopart.com/General-Multilayer-Ceramic-Capacitors-Samsung-datasheet-family-111.pdf; ComponentLink5URL: https://datasheet.octopart.com:443/CL10B472KB8NNNC-Samsung-Electro-Mechanics-datasheet-116051295.pdf?src-supplier=Future+Electronics; ComponentLink5Description: https://datasheet.octopart.com:443/CL10B472KB8NNNC-Samsung-Electro-Mechanics-datasheet-116051295.pdf?src-supplier=Future+Electronics; ComponentLink6URL: https://datasheet.octopart.com:443/CL10B472KB8NNNC-Samsung-Electro-Mechanics-datasheet-81461904.pdf?src-supplier=Future+Electronics; ComponentLink6Description: https://datasheet.octopart.com:443/CL10B472KB8NNNC-Samsung-Electro-Mechanics-datasheet-81461904.pdf?src-supplier=Future+Electronics; ComponentLink7URL: https://datasheet.octopart.com:443/CL10B472KB8NNNC-Samsung-datasheet-26669060.pdf?src-supplier=Future+Electronics; ComponentLink7Description: https://datasheet.octopart.com:443/CL10B472KB8NNNC-Samsung-datasheet-26669060.pdf?src-supplier=Future+Electronics; ComponentLink8URL: https://datasheet.octopart.com:443/CL10B472KB8NNNC-Samsung-Electro-Mechanics-datasheet-149136855.pdf?src-supplier=Future+Electronics; ComponentLink8Description: https://datasheet.octopart.com:443/CL10B472KB8NNNC-Samsung-Electro-Mechanics-datasheet-149136855.pdf?src-supplier=Future+Electronics; ComponentLink9URL: https://datasheet.octopart.com:443/CL10B472KB8NNNC-Samsung-datasheet-37081328.pdf?src-supplier=Future+Electronics; ComponentLink9Description: https://datasheet.octopart.com:443/CL10B472KB8NNNC-Samsung-datasheet-37081328.pdf?src-supplier=Future+Electronics; ComponentLink10URL: https://datasheet.octopart.com:443/CL10B472KB8NNNC-Samsung-datasheet-8326407.pdf?src-supplier=TME; ComponentLink10Description: https://datasheet.octopart.com:443/CL10B472KB8NNNC-Samsung-datasheet-8326407.pdf?src-supplier=TME; ComponentLink11URL: http://sigma.octopart.com:80/rohs_certificate/General-Multilayer-Ceramic-Capacitors-Samsung-family-110.pdf?src-supplier=Compliance+Statements; ComponentLink11Description: http://sigma.octopart.com:80/rohs_certificate/General-Multilayer-Ceramic-Capacitors-Samsung-family-110.pdf?src-supplier=Compliance+Statements; ComponentLink12URL: http://sigma.octopart.com:80/rohs_statement/General-Multilayer-Ceramic-Capacitors-Samsung-family-132.pdf?src-supplier=Compliance+Statements; ComponentLink12Description: http://sigma.octopart.com:80/rohs_statement/General-Multilayer-Ceramic-Capacitors-Samsung-family-132.pdf?src-supplier=Compliance+Statements; ComponentLink13URL: http://sigma.octopart.com:80/reach_statement/General-Multilayer-Ceramic-Capacitors-Samsung-family-133.pdf?src-supplier=Compliance+Statements; ComponentLink13Description: http://sigma.octopart.com:80/reach_statement/General-Multilayer-Ceramic-Capacitors-Samsung-family-133.pdf?src-supplier=Compliance+Statements; ComponentLink14Description: Tedarikçi; ComponentLink14URL: https://www.ozdisan.com/p/smt-smd-ve-mlcc-kapasitorler-184/samsung-cl10b472kb8nnnc-14009
C19 = Cap Cer 1nF %10 SMD 0603: Ceramic Capacitor, Multilayer, Ceramic, 50V, 10% +Tol, 10% -Tol, X7R, +-15% TC, 1nF, Surface Mount, 0603 inch; Manufacturer: Samsung Electro-Mechanics; Manufacturer Part Number: CL10B102KB8NNNC; Supplier: Mouser; Supplier Part Number: 187-CL10B102KB8NNNC; RoHS: Compliant; Category: Ceramic Capacitors; Stock: 423929; Pricing: 1=0,1, 10=0,004, 50=0,004, 100=0,004, 1000=0,004, 10000=0,004 (USD); Value: 1nF; Case/Package: 0603; Case Code (Imperial): 0603; Case Code (Metric): 1608; China RoHS: Compliant; Contact Plating: Tin; Depth: 800µm; Dielectric: X7R; Dielectric Material: Ceramic; Height: 900µm; Lead Free: Lead Free; Length: 1.6mm; Lifecycle Status: Production; Material: Ceramic; Max Operating Temperature: 125°C; Min Operating Temperature: -55°C; Mounting Technology: Surface Mount; Number of Terminals: 2; Radiation Hardening: No; REACH SVHC: Yes; Schedule B: 8532240020, 8532240020|8532240020, 8532240020|8532240020|8532240020, 8532240020|8532240020|8532240020|8532240020; Thickness: 889µm; Tolerance: 10%; Voltage: 50V; Voltage Rating: 50V; Voltage Rating (DC): 50V; Width: 800µm; ComponentLink1URL: https://datasheet.octopart.com:443/CL10B102KB8NNNC-Samsung-Electro-Mechanics-datasheet-137699842.pdf?src-supplier=IHS; ComponentLink1Description: https://datasheet.octopart.com:443/CL10B102KB8NNNC-Samsung-Electro-Mechanics-datasheet-137699842.pdf?src-supplier=IHS; ComponentLink2URL: https://datasheet.octopart.com/CL10B102KB8NNNC-Samsung-Electro-Mechanics-datasheet-8324245.pdf; ComponentLink2Description: https://datasheet.octopart.com/CL10B102KB8NNNC-Samsung-Electro-Mechanics-datasheet-8324245.pdf; ComponentLink3URL: https://datasheet.octopart.com/CL10B102KB8NNNC-Samsung-Electro-Mechanics-datasheet-97040617.pdf; ComponentLink3Description: https://datasheet.octopart.com/CL10B102KB8NNNC-Samsung-Electro-Mechanics-datasheet-97040617.pdf; ComponentLink4URL: https://datasheet.octopart.com:443/CL10B102KB8NNNC-Samsung-Electro-Mechanics-datasheet-127092097.pdf?src-supplier=Future+Electronics; ComponentLink4Description: https://datasheet.octopart.com:443/CL10B102KB8NNNC-Samsung-Electro-Mechanics-datasheet-127092097.pdf?src-supplier=Future+Electronics; ComponentLink5URL: https://datasheet.octopart.com:443/CL10B102KB8NNNC-Samsung-Electro-Mechanics-datasheet-81461821.pdf?src-supplier=Future+Electronics; ComponentLink5Description: https://datasheet.octopart.com:443/CL10B102KB8NNNC-Samsung-Electro-Mechanics-datasheet-81461821.pdf?src-supplier=Future+Electronics; ComponentLink6URL: https://datasheet.octopart.com:443/CL10B102KB8NNNC-Samsung-datasheet-44382877.pdf?src-supplier=Future+Electronics; ComponentLink6Description: https://datasheet.octopart.com:443/CL10B102KB8NNNC-Samsung-datasheet-44382877.pdf?src-supplier=Future+Electronics; ComponentLink7URL: https://datasheet.octopart.com:443/CL10B102KB8NNNC-Samsung-datasheet-26589141.pdf?src-supplier=Future+Electronics; ComponentLink7Description: https://datasheet.octopart.com:443/CL10B102KB8NNNC-Samsung-datasheet-26589141.pdf?src-supplier=Future+Electronics; ComponentLink8URL: https://datasheet.octopart.com:443/CL10B102KB8NNNC-Samsung-Electro-Mechanics-datasheet-149158821.pdf?src-supplier=Future+Electronics; ComponentLink8Description: https://datasheet.octopart.com:443/CL10B102KB8NNNC-Samsung-Electro-Mechanics-datasheet-149158821.pdf?src-supplier=Future+Electronics; ComponentLink9URL: https://datasheet.octopart.com:443/CL10B102KB8NNNC-Samsung-datasheet-8326407.pdf?src-supplier=TME; ComponentLink9Description: https://datasheet.octopart.com:443/CL10B102KB8NNNC-Samsung-datasheet-8326407.pdf?src-supplier=TME; ComponentLink10Description: Tedarikçi; ComponentLink10URL: https://www.ozdisan.com/p/smt-smd-ve-mlcc-kapasitorler-184/samsung-cl10b102kb8nnnc-11971
C20 = Cap Cer 10uF %10 SMD 1206 (25V): Ceramic Capacitor, Multilayer, Ceramic, 25V, 10% +Tol, 10% -Tol, X7R, +-15% TC, 10uF, Surface Mount, 1206 inch; Manufacturer: Samsung Electro-Mechanics; Manufacturer Part Number: CL31B106KAHNNNE; Value: 10µF; Supplier: Mouser; Supplier Part Number: 187-CL31B106KAHNNNE; RoHS: Compliant; Category: Ceramic Capacitors; Stock: 482438; Pricing: 1=0,1, 10=0,036, 50=0,036, 100=0,036, 1000=0,036, 10000=0,035 (USD); Case/Package: 1206; Case Code (Imperial): 1206; Case Code (Metric): 3216; China RoHS: Compliant; Depth: 1.6mm; Dielectric: X7R; Dielectric Material: Ceramic; Height: 1.8mm; Length: 3.2mm; Lifecycle Status: Production; Material: Ceramic; Max Operating Temperature: 125°C; Min Operating Temperature: -55°C; Mounting Technology: Surface Mount; Number of Terminals: 2; Radiation Hardening: No; REACH SVHC: Yes; Schedule B: 8532240020, 8532240020|8532240020|8532240020|8532240020|8532240020; Thickness: 1.8034mm; Tolerance: 10%; Voltage: 25V; Voltage Rating: 25V; Voltage Rating (DC): 25V; Width: 1.6mm; ComponentLink1URL: https://datasheet.octopart.com:443/CL31B106KAHNNNE-Samsung-Electro-Mechanics-datasheet-182024324.pdf?src-supplier=IHS; ComponentLink1Description: https://datasheet.octopart.com:443/CL31B106KAHNNNE-Samsung-Electro-Mechanics-datasheet-182024324.pdf?src-supplier=IHS; ComponentLink2URL: https://datasheet.octopart.com:443/CL31B106KAHNNNE-Samsung-Electro-Mechanics-datasheet-136482614.pdf?src-supplier=Samsung+SCT; ComponentLink2Description: https://datasheet.octopart.com:443/CL31B106KAHNNNE-Samsung-Electro-Mechanics-datasheet-136482614.pdf?src-supplier=Samsung+SCT; ComponentLink3URL: https://datasheet.octopart.com:443/CL31B106KAHNNNE-Samsung-Electro-Mechanics-datasheet-11609088.pdf?src-supplier=Future+Electronics; ComponentLink3Description: https://datasheet.octopart.com:443/CL31B106KAHNNNE-Samsung-Electro-Mechanics-datasheet-11609088.pdf?src-supplier=Future+Electronics; ComponentLink4URL: https://datasheet.octopart.com:443/CL31B106KAHNNNE-Samsung-Electro-Mechanics-datasheet-149066873.pdf?src-supplier=Future+Electronics; ComponentLink4Description: https://datasheet.octopart.com:443/CL31B106KAHNNNE-Samsung-Electro-Mechanics-datasheet-149066873.pdf?src-supplier=Future+Electronics; ComponentLink5URL: https://datasheet.octopart.com:443/CL31B106KAHNNNE-Samsung-Electro-Mechanics-datasheet-116051334.pdf?src-supplier=Future+Electronics; ComponentLink5Description: https://datasheet.octopart.com:443/CL31B106KAHNNNE-Samsung-Electro-Mechanics-datasheet-116051334.pdf?src-supplier=Future+Electronics; ComponentLink6URL: https://datasheet.octopart.com:443/CL31B106KAHNNNE-Samsung-Electro-Mechanics-datasheet-81462475.pdf?src-supplier=Future+Electronics; ComponentLink6Description: https://datasheet.octopart.com:443/CL31B106KAHNNNE-Samsung-Electro-Mechanics-datasheet-81462475.pdf?src-supplier=Future+Electronics; ComponentLink7URL: https://datasheet.octopart.com:443/CL31B106KAHNNNE-Samsung-datasheet-42485257.pdf?src-supplier=Future+Electronics; ComponentLink7Description: https://datasheet.octopart.com:443/CL31B106KAHNNNE-Samsung-datasheet-42485257.pdf?src-supplier=Future+Electronics; ComponentLink8URL: https://datasheet.octopart.com/CL31B106KAHNNNE-Samsung-Electro-Mechanics-datasheet-8324245.pdf; ComponentLink8Description: https://datasheet.octopart.com/CL31B106KAHNNNE-Samsung-Electro-Mechanics-datasheet-8324245.pdf; ComponentLink9URL: https://datasheet.octopart.com/CL31B106KAHNNNE-Samsung-Electro-Mechanics-datasheet-97040617.pdf; ComponentLink9Description: https://datasheet.octopart.com/CL31B106KAHNNNE-Samsung-Electro-Mechanics-datasheet-97040617.pdf; ComponentLink10URL: https://datasheet.octopart.com/General-Multilayer-Ceramic-Capacitors-Samsung-datasheet-family-111.pdf; ComponentLink10Description: https://datasheet.octopart.com/General-Multilayer-Ceramic-Capacitors-Samsung-datasheet-family-111.pdf; ComponentLink11URL: https://datasheet.octopart.com:443/CL31B106KAHNNNE-Samsung-datasheet-59220082.pdf?src-supplier=TME; ComponentLink11Description: https://datasheet.octopart.com:443/CL31B106KAHNNNE-Samsung-datasheet-59220082.pdf?src-supplier=TME; ComponentLink12URL: http://sigma.octopart.com:80/rohs_certificate/General-Multilayer-Ceramic-Capacitors-Samsung-family-110.pdf?src-supplier=Compliance+Statements; ComponentLink12Description: http://sigma.octopart.com:80/rohs_certificate/General-Multilayer-Ceramic-Capacitors-Samsung-family-110.pdf?src-supplier=Compliance+Statements; ComponentLink13URL: http://sigma.octopart.com:80/rohs_statement/General-Multilayer-Ceramic-Capacitors-Samsung-family-132.pdf?src-supplier=Compliance+Statements; ComponentLink13Description: http://sigma.octopart.com:80/rohs_statement/General-Multilayer-Ceramic-Capacitors-Samsung-family-132.pdf?src-supplier=Compliance+Statements; ComponentLink14URL: http://sigma.octopart.com:80/reach_statement/General-Multilayer-Ceramic-Capacitors-Samsung-family-133.pdf?src-supplier=Compliance+Statements; ComponentLink14Description: http://sigma.octopart.com:80/reach_statement/General-Multilayer-Ceramic-Capacitors-Samsung-family-133.pdf?src-supplier=Compliance+Statements; ComponentLink15Description: Tedarikçi; ComponentLink15URL: https://www.ozdisan.com/p/smt-smd-ve-mlcc-kapasitorler-184/samsung-cl31b106kahnnne-35896
D1 = DIODE TVS 400W 40V DO214AC SMA: DO-214AC SMA SMAJ 1 Surface Mount Zener Tvs Diode 44.4V 5muA 400W -55C~150C TJ; Manufacturer: HOTTECH; Breakdown Voltage: 46.75V; Clamping Voltage: 64.5V; Direction: Unidirectional; Element Configuration: Single; Forward Voltage: 3.5V; Leakage Current: 5µA; Max Breakdown Voltage: 49.1V; Max Junction Temperature (Tj): 150°C; Max Power Dissipation: 1W; Max Surge Current: 40A; Number of Channels: 1; Peak Pulse Current: 31A; Power Line Protection: No; Reverse Standoff Voltage: 40V; Test Current: 1mA; Supplier: Mouser; Supplier Part Number: 652-SMAJ40A; Manufacturer Part Number: SMAJ40A-HT; RoHS: Compliant; Category: TVS Diodes; Stock: 74885; Pricing: 1=0,37, 10=0,158, 50=0,158, 100=0,099, 1000=0,095, 10000=0,079 (USD); Case/Package: SMA; China RoHS: Non-Compliant; Composition: Zener; Height: 2.29mm; Lifecycle Status: Production; Max Operating Temperature: 150°C; Max Reverse Leakage Current: 5µA; Min Breakdown Voltage: 44.4V; Min Operating Temperature: -55°C; Mounting Technology: Surface Mount; Number of Elements: 1; Pins: 2; Number of Terminals: 2; Number of Unidirectional Channels: 1; Operating Supply Voltage: 3.5V; Peak Pulse Power: 400W; Peak Reverse Current: 5µA; Polarity: Unidirectional; Radiation Hardening: No; REACH SVHC: No; Reverse Breakdown Voltage: 44.4V; Schedule B: 8541100080; Termination: SMD/SMT; ComponentLink1URL: https://datasheet.octopart.com:443/SMAJ40A-Bourns-datasheet-178218646.pdf?src-supplier=TME; ComponentLink1Description: https://datasheet.octopart.com:443/SMAJ40A-Bourns-datasheet-178218646.pdf?src-supplier=TME; ComponentLink2URL: https://datasheet.octopart.com:443/SMAJ40A-Bourns-datasheet-112042111.pdf?src-supplier=Newark; ComponentLink2Description: https://datasheet.octopart.com:443/SMAJ40A-Bourns-datasheet-112042111.pdf?src-supplier=Newark; ComponentLink3URL: https://datasheet.octopart.com:443/SMAJ40A-Bourns-datasheet-42429164.pdf?src-supplier=Newark; ComponentLink3Description: https://datasheet.octopart.com:443/SMAJ40A-Bourns-datasheet-42429164.pdf?src-supplier=Newark; ComponentLink4URL: https://datasheet.octopart.com:443/SMAJ40A-Bourns-datasheet-182247548.pdf?src-supplier=IHS; ComponentLink4Description: https://datasheet.octopart.com:443/SMAJ40A-Bourns-datasheet-182247548.pdf?src-supplier=IHS; ComponentLink5URL: https://datasheet.octopart.com:443/SMAJ40A-Bourns-datasheet-13385887.pdf?src-supplier=Electro+Sonic; ComponentLink5Description: https://datasheet.octopart.com:443/SMAJ40A-Bourns-datasheet-13385887.pdf?src-supplier=Electro+Sonic; ComponentLink6URL: https://datasheet.octopart.com:443/SMAJ40A-Bourns-datasheet-154729895.pdf?src-supplier=Electro+Sonic; ComponentLink6Description: https://datasheet.octopart.com:443/SMAJ40A-Bourns-datasheet-154729895.pdf?src-supplier=Electro+Sonic; ComponentLink7URL: https://datasheet.octopart.com:443/SMAJ40A-Bourns-datasheet-154729573.pdf?src-supplier=RS+(Formerly+Allied+Electronics); ComponentLink7Description: https://datasheet.octopart.com:443/SMAJ40A-Bourns-datasheet-154729573.pdf?src-supplier=RS+(Formerly+Allied+Electronics); ComponentLink8URL: https://datasheet.octopart.com:443/SMAJ40A-Bourns-datasheet-14047643.pdf?src-supplier=iiiC; ComponentLink8Description: https://datasheet.octopart.com:443/SMAJ40A-Bourns-datasheet-14047643.pdf?src-supplier=iiiC; ComponentLink9URL: http://sigma.octopart.com:80/conflict_mineral_statement/Bourns-company-36.pdf?src-supplier=Compliance+Statements; ComponentLink9Description: http://sigma.octopart.com:80/conflict_mineral_statement/Bourns-company-36.pdf?src-supplier=Compliance+Statements; ComponentLink10Description: Tedarikçi; ComponentLink10URL: https://www.ozdisan.com/p/tvs-diyotlar-386/hottech-smaj40a-ht-512674
D3 = MMSZ15V-HT: DIODE ZENER 500mW 15V ±5% SOD123 SMT; Voltaj - Zener (Nom) (Vz): 15 V15 V; Ters Akım: 45 nA; ComponentLink1Description: Tedarikçi; ComponentLink1URL: https://www.ozdisan.com/p/zener-diyotlar-390/hottech-mmsz15v-ht-465503; Güç (Max): 500mW; Kılıf / Kasa: SOD123; Montaj Tipi: SMT
D4 = LED GREEN 0805: Single Color LED, Brilliant Yellow Green, Water Clear, 1.4mm; Manufacturer: Everlight; Manufacturer Part Number: 17-21/G6C-FM1N2B/4T; Forward Current: 25mA; Forward Voltage: 2.35V; Luminous Intensity: 18mcd; Number of Circuits: 1; Peak Wavelength: 575nm; Reverse Voltage: 5V; Shape: Rectangular; Supplier: Future Electronics; Supplier Part Number: 2187640; RoHS: Compliant; Category: LEDs; Pricing: 4000=0,0235, 12000=0,023, 20000=0,0227, 80000=0,0221, 120000=0,0216 (USD); Height: 1.1mm; Lifecycle Status: Production; Max Operating Temperature: 85°C; Min Operating Temperature: -40°C; Mounting Technology: Surface Mount; Number of Terminals: 2; REACH SVHC: Yes; Terminal Pitch: 1.6mm; Viewing Angle: 140°; ComponentLink1URL: https://datasheet.octopart.com:443/17-21-G6C-FM1N2B-4T-Everlight-datasheet-182278283.pdf?src-supplier=IHS; ComponentLink1Description: https://datasheet.octopart.com:443/17-21-G6C-FM1N2B-4T-Everlight-datasheet-182278283.pdf?src-supplier=IHS; ComponentLink2Description: Tedarikçi; ComponentLink2URL: https://www.ozdisan.com/p/sinyal-ledler-tek-renkli-361/everlight-17-21-g6c-fm1n2b-4t-745079
D5 = LED RED 0805: Single Color LED, Brilliant Red, Water Clear, 1.4mm; Manufacturer: Everlight; Manufacturer Part Number: 17-21/R6C-AP1Q2L/4T; Forward Current: 25mA; Forward Voltage: 2.3V; Luminous Intensity: 45mcd; Number of Circuits: 1; Peak Wavelength: 632nm; Reverse Voltage: 5V; Shape: Rectangular; Viewing Angle: 140°; Supplier: Future Electronics; Supplier Part Number: 3156045; RoHS: Compliant; Category: LEDs; Pricing: 4000=0,0312, 12000=0,0305, 20000=0,0301, 60000=0,0294, 100000=0,0288 (USD); Height: 1mm; Lifecycle Status: Production; Max Operating Temperature: 85°C; Min Operating Temperature: -40°C; Mounting Technology: Surface Mount; Number of Terminals: 2; REACH SVHC: Yes; ComponentLink1URL: https://datasheet.octopart.com:443/17-21-R6C-AP1Q2L-4T-Everlight-datasheet-116384818.pdf?src-supplier=IHS; ComponentLink1Description: https://datasheet.octopart.com:443/17-21-R6C-AP1Q2L-4T-Everlight-datasheet-116384818.pdf?src-supplier=IHS; ComponentLink2Description: Tedarikçi; ComponentLink2URL: https://www.ozdisan.com/p/sinyal-ledler-tek-renkli-361/everlight-17-21-r6c-ap1q2l-4t-752951